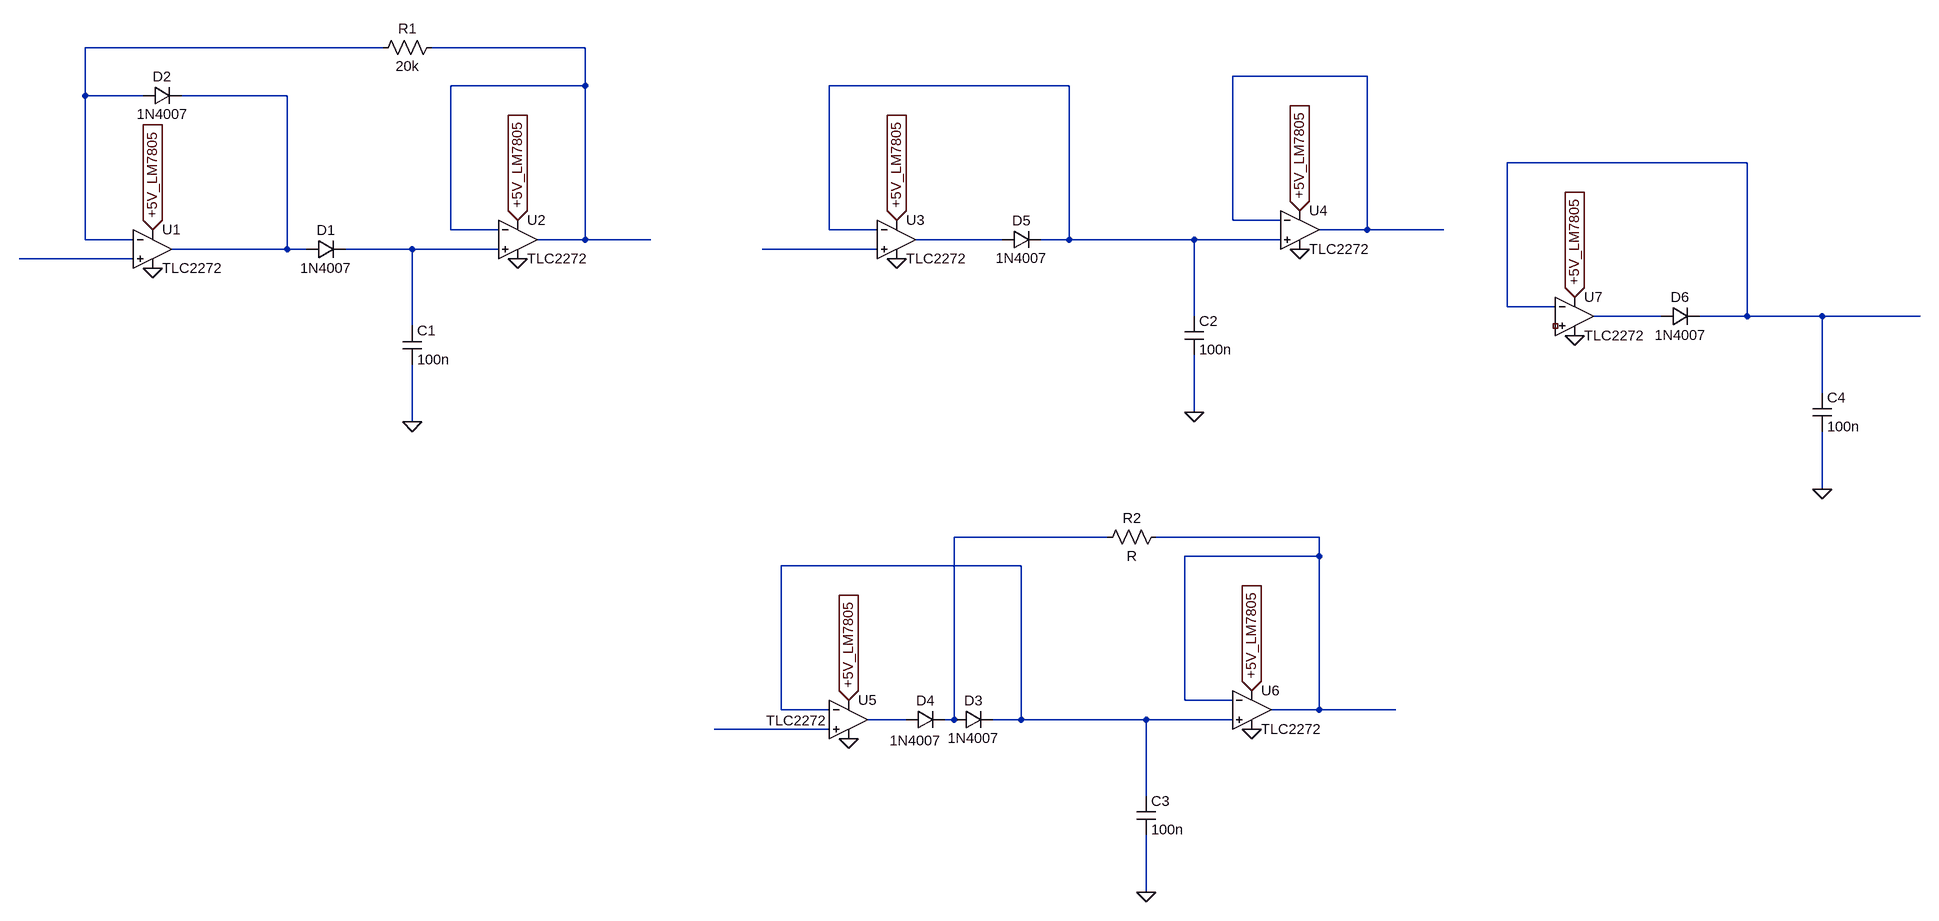
[diagram p0: schematic VarDesigns.asc]
VarDesigns.asc, the LTspice schematic file:
Version 4
SHEET 1 3108 1204
WIRE 48 -224 -512 -224
WIRE 384 -224 128 -224
WIRE 1744 -176 1520 -176
WIRE 384 -160 384 -224
WIRE 384 -160 160 -160
WIRE 1248 -160 848 -160
WIRE -512 -144 -512 -224
WIRE -416 -144 -512 -144
WIRE -112 -144 -352 -144
WIRE 2688 -32 2288 -32
WIRE 1520 64 1520 -176
WIRE 1600 64 1520 64
WIRE 160 80 160 -160
WIRE 240 80 160 80
WIRE 848 80 848 -160
WIRE 928 80 848 80
WIRE 1744 80 1744 -176
WIRE 1744 80 1664 80
WIRE 1872 80 1744 80
WIRE -512 96 -512 -144
WIRE -432 96 -512 96
WIRE 384 96 384 -160
WIRE 384 96 304 96
WIRE 512 96 384 96
WIRE 1136 96 992 96
WIRE 1248 96 1248 -160
WIRE 1248 96 1200 96
WIRE 1456 96 1248 96
WIRE 1600 96 1456 96
WIRE -112 112 -112 -144
WIRE -112 112 -368 112
WIRE -80 112 -112 112
WIRE 96 112 -16 112
WIRE 240 112 96 112
WIRE 928 112 736 112
WIRE -432 128 -624 128
WIRE 2288 208 2288 -32
WIRE 2368 208 2288 208
WIRE 1456 224 1456 96
WIRE 2544 224 2432 224
WIRE 2688 224 2688 -32
WIRE 2688 224 2608 224
WIRE 2896 224 2688 224
WIRE 3104 224 2896 224
WIRE 96 240 96 112
WIRE 2896 352 2896 224
WIRE 1456 384 1456 288
WIRE 96 400 96 304
WIRE 2896 512 2896 416
WIRE 1312 592 1056 592
WIRE 1664 592 1392 592
WIRE 1664 624 1664 592
WIRE 1664 624 1440 624
WIRE 1168 640 768 640
WIRE 1440 864 1440 624
WIRE 1520 864 1440 864
WIRE 768 880 768 640
WIRE 848 880 768 880
WIRE 1664 880 1664 624
WIRE 1664 880 1584 880
WIRE 1792 880 1664 880
WIRE 976 896 912 896
WIRE 1056 896 1056 592
WIRE 1056 896 1040 896
WIRE 1168 896 1168 640
WIRE 1168 896 1120 896
WIRE 1376 896 1168 896
WIRE 1520 896 1376 896
WIRE 848 912 656 912
WIRE 1376 1024 1376 896
WIRE 1376 1184 1376 1088
FLAG 96 400 0
FLAG -400 80 +5V_LM7805
IOPIN -400 80 In
FLAG 272 64 +5V_LM7805
IOPIN 272 64 In
FLAG -400 144 0
FLAG 272 128 0
FLAG 1456 384 0
FLAG 960 64 +5V_LM7805
IOPIN 960 64 In
FLAG 1632 48 +5V_LM7805
IOPIN 1632 48 In
FLAG 960 128 0
FLAG 1632 112 0
FLAG 1376 1184 0
FLAG 880 864 +5V_LM7805
IOPIN 880 864 In
FLAG 1552 848 +5V_LM7805
IOPIN 1552 848 In
FLAG 880 928 0
FLAG 1552 912 0
FLAG 2896 512 0
FLAG 2400 192 +5V_LM7805
IOPIN 2400 192 In
FLAG 2400 256 0
SYMBOL cap 80 240 R0
SYMATTR InstName C1
SYMATTR Value 100n
SYMBOL Opamps\\opamp2 -400 48 R0
SYMATTR InstName U1
SYMATTR Value TLC2272
SYMBOL Opamps\\opamp2 272 32 R0
SYMATTR InstName U2
SYMATTR Value TLC2272
SYMBOL res 144 -240 R90
WINDOW 0 0 56 VBottom 2
WINDOW 3 32 56 VTop 2
SYMATTR InstName R1
SYMATTR Value 20k
SYMBOL diode -80 128 R270
WINDOW 0 32 32 VTop 2
WINDOW 3 0 32 VBottom 2
SYMATTR InstName D1
SYMATTR Value 1N4007
SYMBOL diode -416 -128 R270
WINDOW 0 32 32 VTop 2
WINDOW 3 0 32 VBottom 2
SYMATTR InstName D2
SYMATTR Value 1N4007
SYMBOL cap 1440 224 R0
SYMATTR InstName C2
SYMATTR Value 100n
SYMBOL Opamps\\opamp2 960 32 R0
SYMATTR InstName U3
SYMATTR Value TLC2272
SYMBOL Opamps\\opamp2 1632 16 R0
SYMATTR InstName U4
SYMATTR Value TLC2272
SYMBOL diode 1136 112 R270
WINDOW 0 32 32 VTop 2
WINDOW 3 0 32 VBottom 2
SYMATTR InstName D5
SYMATTR Value 1N4007
SYMBOL cap 1360 1024 R0
SYMATTR InstName C3
SYMATTR Value 100n
SYMBOL Opamps\\opamp2 880 832 R0
WINDOW 3 -137 66 Left 2
SYMATTR InstName U5
SYMATTR Value TLC2272
SYMBOL Opamps\\opamp2 1552 816 R0
SYMATTR InstName U6
SYMATTR Value TLC2272
SYMBOL diode 1056 912 R270
WINDOW 0 32 32 VTop 2
WINDOW 3 0 32 VBottom 2
SYMATTR InstName D3
SYMATTR Value 1N4007
SYMBOL diode 976 912 R270
WINDOW 0 32 32 VTop 2
WINDOW 3 -4 15 VBottom 2
SYMATTR InstName D4
SYMATTR Value 1N4007
SYMBOL res 1408 576 R90
WINDOW 0 0 56 VBottom 2
WINDOW 3 32 56 VTop 2
SYMATTR InstName R2
SYMBOL cap 2880 352 R0
SYMATTR InstName C4
SYMATTR Value 100n
SYMBOL Opamps\\opamp2 2400 160 R0
SYMATTR InstName U7
SYMATTR Value TLC2272
SYMBOL diode 2544 240 R270
WINDOW 0 32 32 VTop 2
WINDOW 3 0 32 VBottom 2
SYMATTR InstName D6
SYMATTR Value 1N4007

The netlist it stands for:
* VarDesigns.asc
C1 N008 0 100n
XU1 N010 N001 +5V_LM7805 0 N005 TLC2272  ; pins In+ In- V+ V- OUT
XU2 N008 N002 +5V_LM7805 0 N002 TLC2272  ; pins In+ In- V+ V- OUT
R1 N002 N001 20k
D1 N005 N008 1N4007
D2 N001 N005 1N4007
C2 N004 0 100n
XU3 N009 N004 +5V_LM7805 0 N007 TLC2272  ; pins In+ In- V+ V- OUT
XU4 N004 N003 +5V_LM7805 0 N003 TLC2272  ; pins In+ In- V+ V- OUT
D5 N007 N004 1N4007
C3 N014 0 100n
XU5 N016 N014 +5V_LM7805 0 N015 TLC2272  ; pins In+ In- V+ V- OUT
XU6 N014 N013 +5V_LM7805 0 N013 TLC2272  ; pins In+ In- V+ V- OUT
D3 N012 N014 1N4007
D4 N015 N012 1N4007
R2 N013 N012 R
C4 N006 0 100n
XU7 NC_01 N006 +5V_LM7805 0 N011 TLC2272  ; pins In+ In- V+ V- OUT
D6 N011 N006 1N4007
.model D D
.lib standard.dio
.backanno
.end